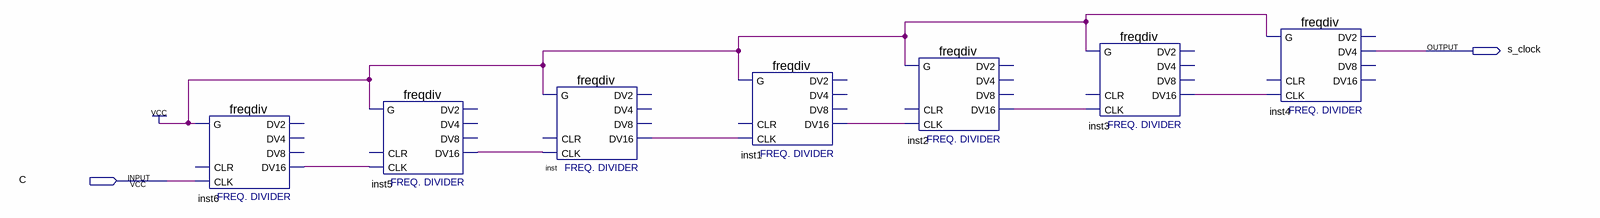
[diagram p0: schematic sheet]
// Quartus schematic clock_divisor.bdf as structural Verilog: 7 symbols, 2 pins
module clock_divisor (
  input  C,
  output s_clock
);

  wire inst1_dv16, inst2_dv16, inst3_dv16, inst5_dv16, inst6_dv16, inst_dv16;

  freqdiv inst6 (.CLK(C), .G(1'b1), .DV16(inst6_dv16));  // open: CLR, DV2, DV4, DV8
  freqdiv inst5 (.CLK(inst6_dv16), .G(1'b1), .DV16(inst5_dv16));  // open: CLR, DV2, DV4, DV8
  freqdiv inst (.CLK(inst5_dv16), .G(1'b1), .DV16(inst_dv16));  // open: CLR, DV2, DV4, DV8
  freqdiv inst1 (.CLK(inst_dv16), .G(1'b1), .DV16(inst1_dv16));  // open: CLR, DV2, DV4, DV8
  freqdiv inst2 (.CLK(inst1_dv16), .G(1'b1), .DV16(inst2_dv16));  // open: CLR, DV2, DV4, DV8
  freqdiv inst3 (.CLK(inst2_dv16), .G(1'b1), .DV16(inst3_dv16));  // open: CLR, DV2, DV4, DV8
  freqdiv inst4 (.CLK(inst3_dv16), .G(1'b1), .DV4(s_clock));  // open: CLR, DV2, DV8, DV16
endmodule
